# EAGLE design MaTouch Devkit_Stepper Driver V1.1 (EAGLE 6.1)
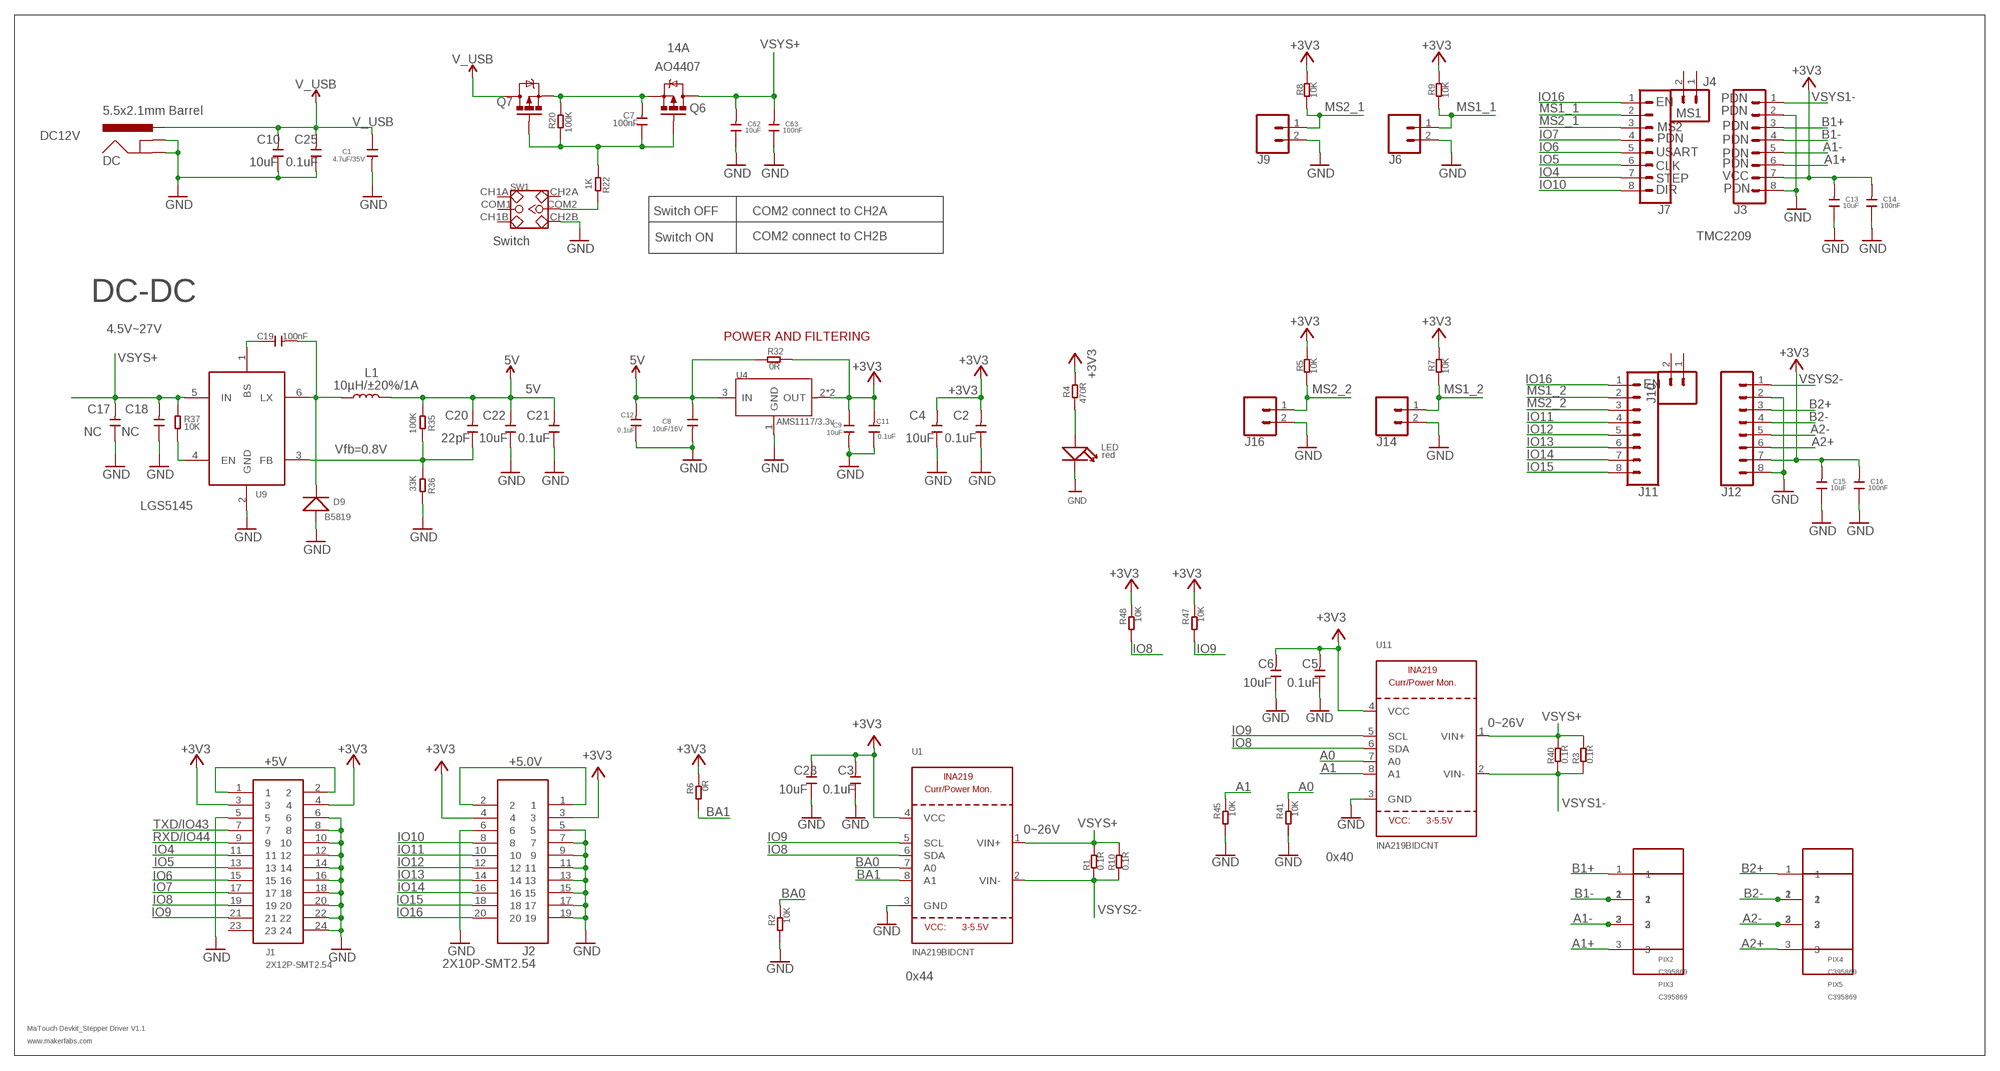
[diagram p0: schematic, sheet 1]

## Parts
C1  4.7uF/35V  C-0603  [0603]
C2  0.1uF  C-0603  [0603]
C3  0.1uF  C-0603  [0603]
C4  10uF  C-0603  [0603]
C5  0.1uF  C-0603  [0603]
C6  10uF  C-0603  [0603]
C7  100nF  C-0603  [0603]
C8  10uF/16V  C-0603  [0603]
C9  10uF  C-0603  [0603]
C10  10uF  C-0603  [0603]
C11  0.1uF  C-0603  [0603]
C12  0.1uF  C-0603  [0603]
C13  10uF  C-0603  [0603]
C14  100nF  C-0603  [0603]
C15  10uF  C-0603  [0603]
C16  100nF  C-0603  [0603]
C17  NC  C-0603  [0603]
C18  NC  C-0603  [0603]
C19  100nF  C-0603  [0603]
C20  22pF  C-0603  [0603]
C21  0.1uF  C-0603  [0603]
C22  10uF  C-0603  [0603]
C23  10uF  C-0603  [0603]
C25  0.1uF  C-0603  [0603]
C62  10uF  C-0603  [0603]
C63  100nF  C-0603  [0603]
D9  B5819  D'1206'  [SOD123]
DC  5.5x2.1mm Barrel  POWER_JACKSMD  [POWER_JACK_SMD]
J1  2X12P-SMT2.54  [2X12P-SMT2.54]
J2  2X10P-SMT2.54  [2X10P-SMT2.54]
J3  CONN_08"  [1X08]
J4  CONN_02LOCK  [1X02_LOCK]
J6  CONN_02LOCK  [1X02_LOCK]
J7  CONN_08"  [1X08]
J9  CONN_02LOCK  [1X02_LOCK]
J10  CONN_02LOCK  [1X02_LOCK]
J11  CONN_08"  [1X08]
J12  CONN_08"  [1X08]
J14  CONN_02LOCK  [1X02_LOCK]
J16  CONN_02LOCK  [1X02_LOCK]
L1  10µH/±20%/1A  INDUCTOR-SRN6045-33UH  [SRN6045]
LED  red  DISCRETE_LED0603  [DISCRETE_LED-0603]
PIX2  C395869  [PIN_3P]
PIX3  C395869  [PIN_3P]
PIX4  C395869  [PIN_3P]
PIX5  C395869  [PIN_3P]
Q6  MOSFET-PCHANNELFDS6675  [SO08]
Q7  MOSFET-PCHANNELFDS6675  [SO08]
R1  0.1R  DISCRETE_R-2512  [DISCRETE_R2512]
R2  10K  R-0603  [R0603]
R3  0.1R  DISCRETE_R-2512  [DISCRETE_R2512]
R4  470R  R-0603  [R0603]
R5  10K  R-0603  [R0603]
R6  0R  R-0603  [R0603]
R7  10K  R-0603  [R0603]
R8  10K  R-0603  [R0603]
R9  10K  R-0603  [R0603]
R10  0.1R  DISCRETE_R-2512  [DISCRETE_R2512]
R20  100K  R-0603  [R0603]
R22  1K  R-0603  [R0603]
R32  0R  R-0603  [R0603]
R35  100K  R-0603  [R0603]
R36  33K  R-0603  [R0603]
R37  10K  R-0603  [R0603]
R40  0.1R  DISCRETE_R-2512  [DISCRETE_R2512]
R41  10K  R-0603  [R0603]
R45  10K  R-0603  [R0603]
R47  10K  R-0603  [R0603]
R48  10K  R-0603  [R0603]
SW1  SWITCH-2CH-6P'90D'  [6P-2CH-2.54-9.0X3.6-90D]
U1  INA219BIDCNT  INA219  [SOT23-8]
U4  AMS1117/3.3v  LD1117'SOT89'  [SOT89]
U9  SY8201ABC  [SOT-23-6]
U11  INA219BIDCNT  INA219  [SOT23-8]

## Nets
5V: C8.1 C12.2 C20.2 C21.2 C22.2 L1.2 R32.1 R35.1 U4.3(IN)
+3V3: C2.2 C3.2 C4.2 C5.2 C6.2 C9.1 C11.2 C13.2 C14.2 C15.2 C16.2 C23.2 J1.3 J1.4 J2.3 J2.4 J3.7 J12.7 R4.2 R5.2 R6.2 R7.2 R8.2 R9.2 R32.2 R47.2 R48.2 U1.4(VCC) U4.2(OUT) U4.4(OUT) U11.4(VCC)
+5.0V: J2.1 J2.2
+5V: J1.1 J1.2
A0: R41.2 U11.7(A0)
A1: R45.2 U11.8(A1)
A1+: J3.6 PIX3.3
A1-: J3.5 PIX2.3 PIX3.2
A2+: J12.6 PIX5.3
A2-: J12.5 PIX4.3 PIX5.2
B1+: J3.3 PIX2.1
B1-: J3.4 PIX2.2 PIX3.1
B2+: J12.3 PIX4.1
B2-: J12.4 PIX4.2 PIX5.1
BA0: R2.2 U1.7(A0)
BA1: R6.1 U1.8(A1)
GND: C1.2 C2.1 C3.1 C4.1 C5.1 C6.1 C8.2 C9.2 C10.1 C11.1 C12.1 C13.1 C14.1 C15.1 C16.1 C17.1 C18.1 C21.1 C22.1 C23.1 C25.1 C62.1 C63.1 D9.+ DC.GND(GNDBREAK) DC.P$4(GND) J1.5 J1.6 J1.8 J1.10 J1.12 J1.14 J1.16 J1.18 J1.20 J1.22 J1.24 J2.5 J2.6 J2.7 J2.9 J2.11 J2.13 J2.15 J2.17 J2.19 J3.2 J3.8 J6.2 J9.2 J12.2 J12.8 J14.2 J16.2 LED.- R2.1 R36.2 R41.1 R45.1 SW1.CH2B U1.3(GND) U4.1(GND) U9.2(GND) U11.3(GND)
IO4: J1.11 J7.7
IO5: J1.13 J7.6
IO6: J1.15 J7.5
IO7: J1.17 J7.4
IO8: J1.19 R48.1 U1.6(SDA) U11.6(SDA)
IO9: J1.21 R47.1 U1.5(SCL) U11.5(SCL)
IO10: J2.8 J7.8
IO11: J2.10 J11.4
IO12: J2.12 J11.5
IO13: J2.14 J11.6
IO14: J2.16 J11.7
IO15: J2.18 J11.8
IO16: J2.20 J7.1 J11.1
MS1_1: J6.1 J7.2 R9.1
MS1_2: J11.2 J14.1 R7.1
MS2_1: J7.3 J9.1 R8.1
MS2_2: J11.3 J16.1 R5.1
N$2: LED.+ R4.1
N$9: C7.1 Q6.4(G) Q7.4(G) R20.2 R22.2
N$10: R22.1 SW1.COM2
N$41: C19.2 D9.- L1.1 U9.6(LX)
N$42: C19.1 U9.1(BS)
N$43: C20.1 R35.2 R36.1 U9.3(FB)
N$44: R37.2 U9.4(EN)
N$49: C7.2 Q6.1(S) Q6.2(S) Q6.3(S) Q7.1(S) Q7.2(S) Q7.3(S) R20.1
RXD/IO44: J1.9
TXD/IO43: J1.7
V_USB: C1.1 C10.2 C25.2 DC.VIN0(PWR) Q7.5(D) Q7.6(D) Q7.7(D) Q7.8(D)
VSYS1-: J3.1 R3.1 R40.1 U11.2(VIN-)
VSYS2-: J12.1 R1.1 R10.1 U1.2(VIN-)
VSYS+: C17.2 C18.2 C62.2 C63.2 Q6.5(D) Q6.6(D) Q6.7(D) Q6.8(D) R1.2 R3.2 R10.2 R37.1 R40.2 U1.1(VIN+) U9.5(IN) U11.1(VIN+)
Unconnected: J1.23 J4.1 J4.2 J10.1 J10.2 SW1.CH1A SW1.CH1B SW1.CH2A SW1.COM1

## Notes on the sheet
- 14A
- AO4407
- PDN
- EN
- MS1 | PDN
- MS2 | PDN
- DC12V | PDN
- PDN
- USART | PDN
- CLK | PDN
- STEP | VCC
- DIR | PDN
- Switch OFF | COM2 connect to CH2A
- Switch ON | COM2 connect to CH2B | TMC2209
- Switch
- DC-DC
- 4.5V~27V
- POWER AND FILTERING
- EN
- Vfb=0.8V
- LGS5145
- 0~26V
- 0~26V
- 0x40
- 0x44
- MaTouch Devkit_Stepper Driver V1.1
- www.makerfabs.com

## Library data of the parts
C1-C23 C25 C62 C63 = Discrete:C*: Ceramic Capacitors
D9 = Discrete:D*
DC = SparkFun-Connectors:POWER_JACK: Power Jack Connector This is the standard 5.5mm barrel jack for power. The PTH is the most common, proven, reliable, footprint. The Slot footprint only works if the mill layer is transmitted to the PCB fab house so be warned. Here are the connectors we sell at SparkFun: DC Barrel Power Jack/Connector <https://www.sparkfun.com/products/119> (PRT-00119) DC Barrel Power Jack/Connector (SMD) <https://www.sparkfun.com/products/12748> (PRT-12748) DC Barrel Jack Adapter - Breadboard Compatible <https://www.sparkfun.com/products/10811> (PRT-10811) It is used on this SparkFun product (and many, many others): SparkFun RedBoard - Programmed with Arduino <https://www.sparkfun.com/products/12757> (DEV-12757) Also, if you need a mating power supply or connector, please check these out: Wall Adapter Power Supply - 9VDC 650mA <https://www.sparkfun.com/products/298> (TOL-00298) DC Barrel Jack Adapter - Male <https://www.sparkfun.com/products/10287> (PRT-10287); PROD_ID: CONN-08106; SF_ID: PRT-12748
J1 = sale:2X12P-SMT2.54
J2 = sale:2X10P-SMT2.54
J3 J7 J11 J12 = SparkFun-Connectors:CONN_08: Multi connection point. Often used as Generic Header-pin footprint for 0.1 inch spaced/style header connections On any of the 0.1 inch spaced packages, you can populate with these: Break Away Headers - Straight <https://www.sparkfun.com/products/116> (PRT-00116) Break Away Male Headers - Right Angle <https://www.sparkfun.com/products/553> (PRT-00553) Female Headers <https://www.sparkfun.com/products/115> (PRT-00115) Break Away Headers - Machine Pin <https://www.sparkfun.com/products/117> (PRT-00117) Break Away Female Headers - Swiss Machine Pin <https://www.sparkfun.com/products/743> (PRT-00743) Arduino Stackable Header - 8 Pin <https://www.sparkfun.com/products/9279> (PRT-09279) For SCREWTERMINALS and SPRING TERMINALS visit here: Screw Terimnals on SparkFun.com <https://www.sparkfun.com/search/results?term=Screw+Terminals> (5mm/3.5mm/2.54mm spacing) This device is also useful as a general connection point to wire up your design to another part of your project. Our various solder wires solder well into these plated through hole pads. Hook-Up Wire - Assortment (Stranded, 22 AWG) <https://www.sparkfun.com/products/11375> (PRT-11375) Hook-Up Wire - Assortment (Solid Core, 22 AWG) <https://www.sparkfun.com/products/11367> (PRT-11367) View the entire wire category on our website here <https://www.sparkfun.com/categories/141> Special notes: Molex polarized connector foot print use with SKU : PRT-08231 with associated crimp pins and housings. 1MM SMD Version SKU: PRT-10208 NOTES ON THE VARIANTS LOCK and LOCK_LONGPADS... This footprint was designed to help hold the alignment of a through-hole component (i.e. 6-pin header) while soldering it into place. You may notice that each hole has been shifted either up or down by 0.005 of an inch from it's more standard position (which is a perfectly straight line). This slight alteration caused the pins (the squares in the middle) to touch the edges of the holes. Because they are alternating, it causes a "brace" to hold the component in place. 0.005 has proven to be the perfect amount of "off-center" position when using our standard breakaway headers. Although looks a little odd when you look at the bare footprint, once you have a header in there, the alteration is very hard to notice. Also,if you push a header all the way into place, it is covered up entirely on the bottom side.; PROD_ID: CONN-08438
J4 J6 J9 J10 J14 J16 = SparkFun-Connectors:CONN_02: Multi connection point. Often used as Generic Header-pin footprint for 0.1 inch spaced/style header connections On any of the 0.1 inch spaced packages, you can populate with these: Break Away Headers - Straight <https://www.sparkfun.com/products/116> (PRT-00116) Break Away Male Headers - Right Angle <https://www.sparkfun.com/products/553> (PRT-00553) Female Headers <https://www.sparkfun.com/products/115> (PRT-00115) Break Away Headers - Machine Pin <https://www.sparkfun.com/products/117> (PRT-00117) Break Away Female Headers - Swiss Machine Pin <https://www.sparkfun.com/products/743> (PRT-00743) For SCREWTERMINALS and SPRING TERMINALS visit here: Screw Terimnals on SparkFun.com <https://www.sparkfun.com/search/results?term=Screw+Terminals> (5mm/3.5mm/2.54mm spacing) This device is also useful as a general connection point to wire up your design to another part of your project. Our various solder wires solder well into these plated through hole pads. Hook-Up Wire - Assortment (Stranded, 22 AWG) <https://www.sparkfun.com/products/11375> (PRT-11375) Hook-Up Wire - Assortment (Solid Core, 22 AWG) <https://www.sparkfun.com/products/11367> (PRT-11367) View the entire wire category on our website here <https://www.sparkfun.com/categories/141> Special notes: Molex polarized connector foot print use with: PRT-08233 with associated crimp pins and housings. 2.54_SCREWTERM for use with PRT-10571. 3.5mm Screw Terminal footprints for PRT-08084 5mm Screw Terminal footprints for use with PRT-08432
L1 = SparkFun-Coils:INDUCTOR: Inductors Resist changes in electrical current. Basically a coil of wire. SparkFun Products: SparkFun Load Cell Amplifier - HX711 <https://www.sparkfun.com/products/13879> IOIO-OTG - V2.2 <https://www.sparkfun.com/products/13613>; PROD_ID: NDUC-11627; VALUE: 33µH/±20%/1.4A
LED = A9G:DISCRETE_LED*
PIX2-PIX5 = 1mytest:C395869
Q6 Q7 = User-Submitted:MOSFET-PCHANNEL: Generic PMOSFET IRLML2244 - TRANS-11153 (SOT-23 -20V -4.3A) (1.Gate 2.Source 3.Drain) FQP27P06 - COM-10349 <http://www.sparkfun.com/products/10349> (TO-220 -60V -27A) (1.Gate 2.Source 3.Drain)
R1 R3 R10 R40 = A9G:DISCRETE_R*
R2 R4-R9 R20 R22 R32 R35-R37 R41 R45 R47 R48 = Discrete:R*
SW1 = Discrete:SWITCH-2CH-6P
U1 U11 = microbuilder:INA219: INA219 - I2C Current/Power Monitor Voltage Range: 0-26V Accuracy: 0.5% Temperature: -40°C - 125°C
U4 = IC:LD1117: Low Drop Fixed And Adjustable Positive Voltage Regulators http://www.datasheetcatalog.org/datasheet/SGSThomsonMicroelectronics/mXuqtqv.pdf
U9 = self:SY8201ABC

## Net classes
0 default: width 0.203 mm, drill 0.305 mm, clearance 0.152 mm

## Board
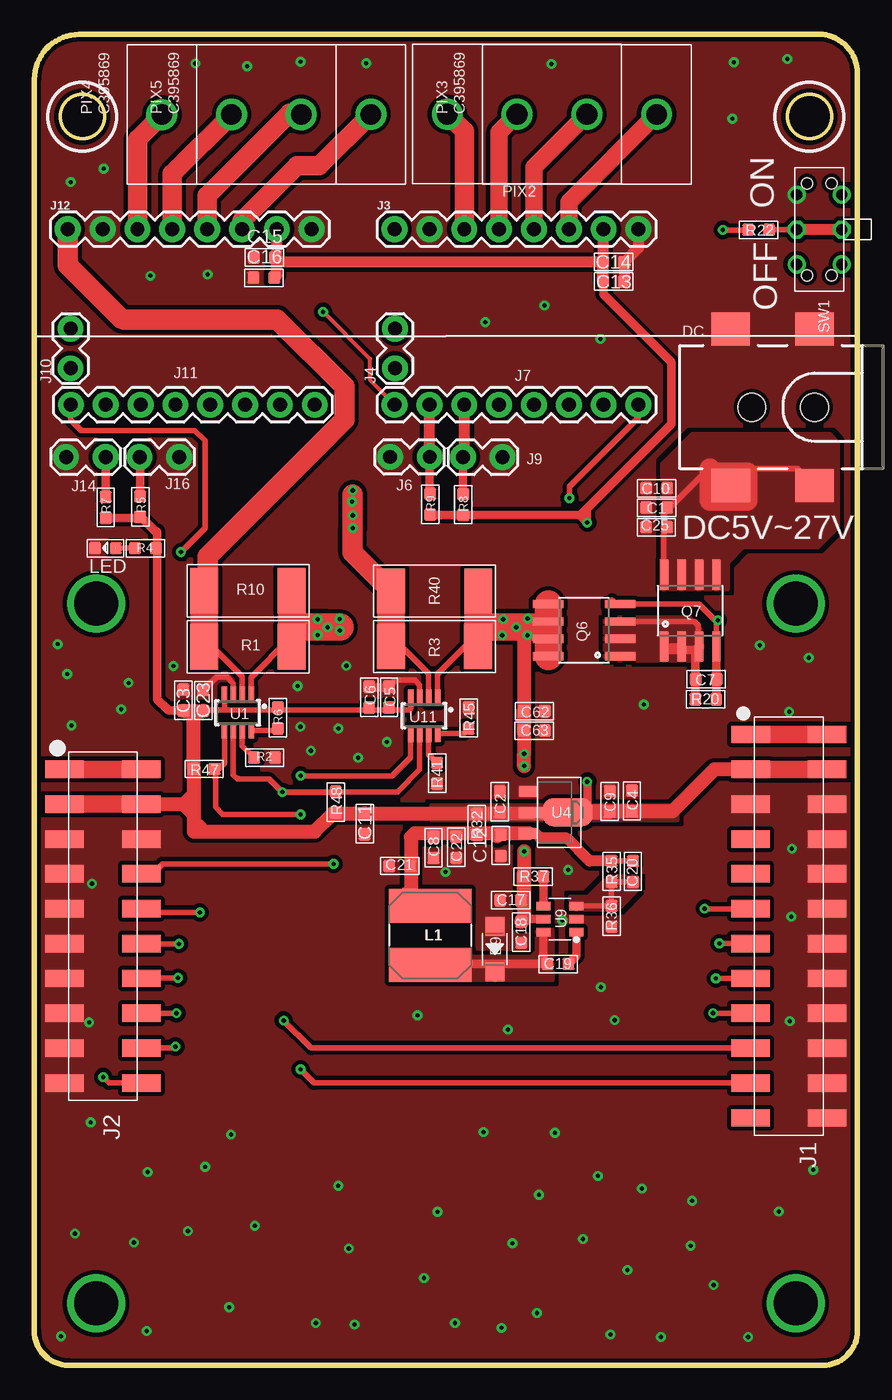
[diagram p1: board, top side]
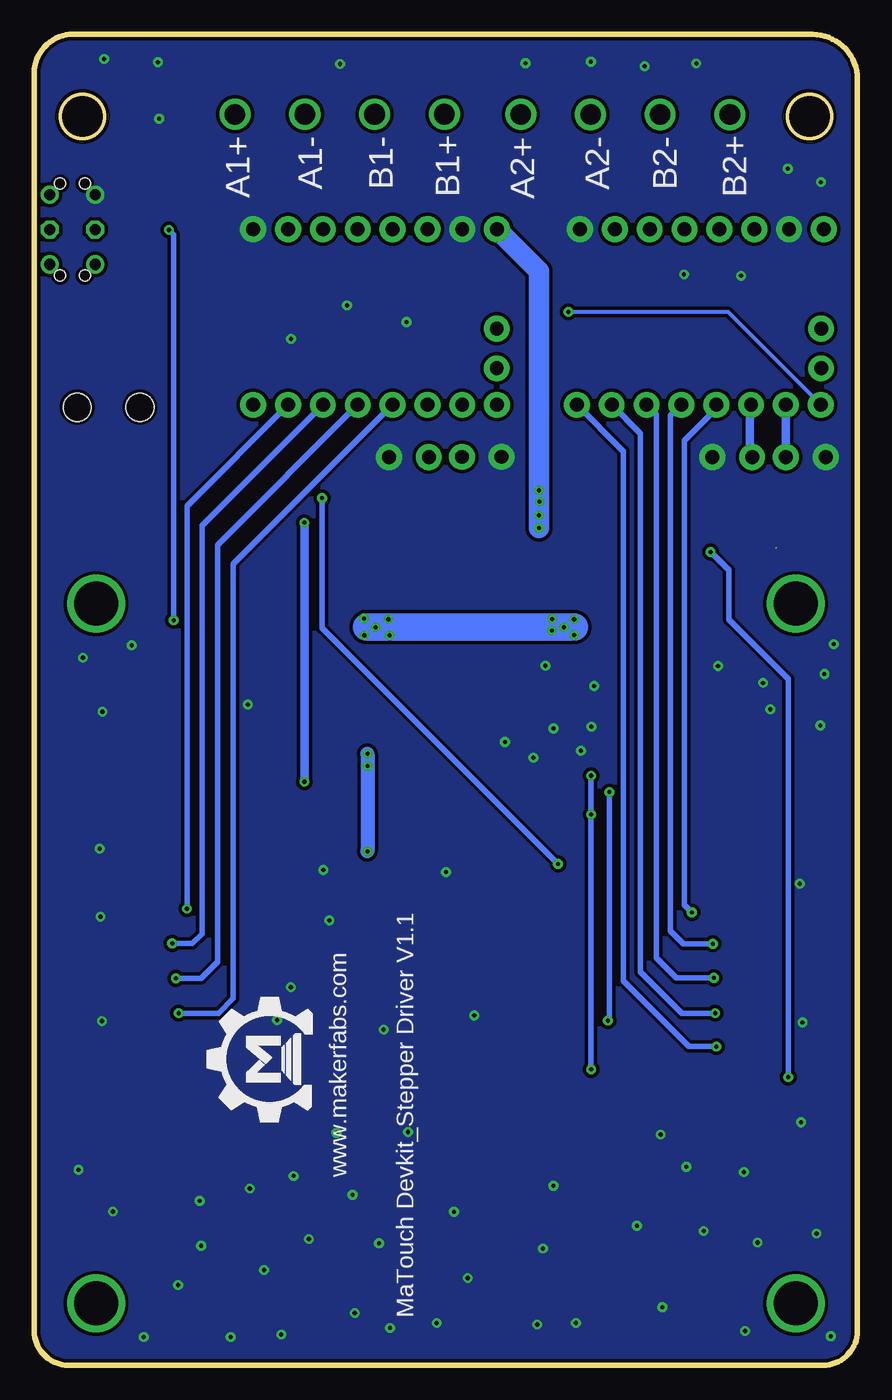
[diagram p2: board, bottom side, seen from below]

Size 60 x 97 mm. Coordinates in mm from the lower left corner, seen from the top.
Outline: 2.5,0 57.5,0 arc90 60,2.5 60,94.16 arc90 57.16,97 3.27,97 arc90 0,93.73 0,2.5 arc90 2.5,0
Outline: circle at 3.5,91 radius 1.6
Outline: circle at 56.5,91 radius 1.6
Copper layers (1*16): Top 0.035mm / dielectric 1.5mm / Bottom 0.035mm
Design rules: minimum track width 10mil, minimum drill 10mil, track to track 8mil, track to pad 8mil, pad to pad 8mil, via to via 8mil, smd to smd 0mil, copper to edge 10mil, drill to drill 8mil, minimum pad ring 10mil, minimum via ring 8mil, stop-mask expansion 4mil, vias tented up to drill 30mil, thermal gap 0mil
tRestrict: area 25.9,30.4 to 31.9,32.2

### Footprints (pad centres in the part's own frame; a part is rotated, then mirrored left to right if it is on the bottom)
0603 = smd 0.889 x 0.889: 1 -0.762,0; 2 0.762,0
SOD123 = smd 1.397 x 1.397: + -1.651,0; - 1.651,0
POWER_JACK_SMD = smd 2.8 x 2.4: GND 0,-5.7; P$4 6.1,-5.7; VIN0 0,5.7; VIN1 6.1,5.7 | hole 2.032: 0,0; 4.572,0
2X12P-SMT2.54 = smd 1.27 x 2.8: 1 -13.97,-2.8; 2 -13.97,2.8; 3 -11.43,-2.8; 4 -11.43,2.8; 5 -8.89,-2.8; 6 -8.89,2.8; 7 -6.35,-2.8; 8 -6.35,2.8; 9 -3.81,-2.8; 10 -3.81,2.8; 11 -1.27,-2.8; 12 -1.27,2.8; 13 1.27,-2.8; 14 1.27,2.8; 15 3.81,-2.8; 16 3.81,2.8; 17 6.35,-2.8; 18 6.35,2.8; 19 8.89,-2.8; 20 8.89,2.8; 21 11.43,-2.8; 22 11.43,2.8; 23 13.97,-2.8; 24 13.97,2.8
2X10P-SMT2.54 = smd 1.27 x 2.8: 1 -11.43,-2.8; 2 -11.43,2.8; 3 -8.89,-2.8; 4 -8.89,2.8; 5 -6.35,-2.8; 6 -6.35,2.8; 7 -3.81,-2.8; 8 -3.81,2.8; 9 -1.27,-2.8; 10 -1.27,2.8; 11 1.27,-2.8; 12 1.27,2.8; 13 3.81,-2.8; 14 3.81,2.8; 15 6.35,-2.8; 16 6.35,2.8; 17 8.89,-2.8; 18 8.89,2.8; 19 11.43,-2.8; 20 11.43,2.8
1X08 = drill 1.016 pad 1.88: 1 0,0; 2 2.54,0; 3 5.08,0; 4 7.62,0; 5 10.16,0; 6 12.7,0; 7 15.24,0; 8 17.78,0
1X02_LOCK = drill 1.016 pad 1.88: 1 -0.178,0; 2 2.718,0
SRN6045 = smd 2.5 x 6: 1 -2.175,0; 2 2.125,0
DISCRETE_LED-0603 = smd 0.889 x 0.889: + -0.762,0; - 0.762,0
PIN_3P = drill 1.5: 1 0,10.16; 2 0,5.08; 3 0,0
SO08 = smd 0.61 x 2.21: 1 -1.905,-2.616; 2 -0.635,-2.616; 3 0.635,-2.616; 4 1.905,-2.616; 5 1.905,2.616; 6 0.635,2.616; 7 -0.635,2.616; 8 -1.905,2.616
DISCRETE_R2512 = smd 2.032 x 3.302: 1 -3.175,0; 2 3.175,0
R0603 = smd 0.889 x 0.889: 1 -0.762,0; 2 0.762,0
6P-2CH-2.54-9.0X3.6-90D = drill 0.813 pad 1.27: CH1A -2.54,-1.65; CH1B 2.54,-1.65; CH2A -2.54,1.65; CH2B 2.54,1.65 | drill 0.813 pad 1.27 octagon: COM1 0,-1.65; COM2 0,1.65 | hole 0.813: -3.35,0.9; -3.35,-0.9; 3.35,0.9; 3.35,-0.9
SOT23-8 = smd 0.4 x 1.2: 1 -0.975,-1.3; 2 -0.325,-1.3; 3 0.325,-1.3; 4 0.975,-1.3; 5 0.975,1.3; 6 0.325,1.3; 7 -0.325,1.3; 8 -0.975,1.3
SOT89 = smd 0.8 x 1.4: 1 -1.524,-1.905; 3 1.524,-1.905 | smd 0.8 x 1.9: 2 0,-1.651 | smd 2.032 x 3.65: 4 0,0.94
SOT-23-6 = smd 1 x 0.6: 1 -1.2,0.95; 2 -1.2,0; 3 -1.2,-0.95; 4 1.2,-0.95; 5 1.2,0; 6 1.2,0.95

### Placement (x,y rotation side)
C1  45.36,62.5 180 top
C2  33.94,41.07 270 top
C3  10.87,48.47 270 top
C4  43.56,41.12 270 top
C5  25.86,48.69 270 top
C6  24.41,48.68 270 top
C7  48.97,50 180 top
C8  29.1,37.73 270 top
C9  41.95,41.08 90 top
C10  45.36,63.92 0 top
C11  24.08,39.46 90 top
C12  34.01,37.88 90 top
C13  42.24,78.98 180 top
C14  42.24,80.4 180 top
C15  16.76,80.73 0 top
C16  16.74,79.26 0 top
C17  34.72,33.9 0 top
C18  35.51,31.55 90 top
C19  38.18,29.24 180 top
C20  43.64,35.98 90 top
C21  26.63,36.39 0 top
C22  30.76,37.74 90 top
C23  12.32,48.45 270 top
C25  45.35,61.08 0 top
C62  36.46,47.67 180 top
C63  36.44,46.25 180 top
D9  33.58,30.32 270 top
DC  56.87,69.82 180 top
J1  55,32 270 top
J2  5,32 270 top
J3  26.26,82.8 0 top
J4  26.29,72.83 90 top
J6  28.65,66.2 180 top
J7  26.26,70 0 top
J9  31.42,66.18 0 top
J10  2.64,72.83 90 top
J11  2.67,70 0 top
J12  2.44,82.8 0 top
J14  5.03,66.18 180 top
J16  7.85,66.18 0 top
L1  28.86,31.35 90 top
LED  5.18,59.55 180 top
PIX2  40.26,91.18 90 top
PIX3  45.36,91.17 90 top
PIX4  19.46,91.15 90 top
PIX5  24.54,91.17 90 top
Q6  40.08,53.57 90 top
Q7  47.82,55 0 top
R1  15.57,52.36 0 top
R2  16.79,44.28 180 top
R3  29.17,52.38 0 top
R4  8.1,59.55 0 top
R5  7.72,62.57 270 top
R6  17.75,47.18 90 top
R7  5.21,62.52 270 top
R8  31.27,62.72 270 top
R9  28.85,62.75 270 top
R10  15.57,56.45 0 top
R20  48.95,48.54 0 top
R22  52.81,82.75 180 top
R32  32.27,39.41 90 top
R35  42.08,35.98 270 top
R36  42.08,32.71 270 top
R37  36.36,35.61 0 top
R40  29.18,56.42 0 top
R41  29.36,43.14 90 top
R45  31.66,47.17 270 top
R47  12.38,43.45 180 top
R48  21.97,41.03 270 top
SW1  57.22,82.77 90 top
U1  14.83,47.56 180 top
U4  37.95,40.29 270 top
U9  38.32,32.51 180 top
U11  28.42,47.33 180 top
U$2  [MAKERFABS_0.3]  39.79,18.18 90 bottom

### Tracks (layer width: path | path; a pad name or v marks a point on that pad's centre or on a via)
5V
  Top 0.254: 27.09,36.39 C21.2 27.09,34.54 27.61,34.02 | 27.7,33.93 28.14,33.49 28.84,33.49 L1.2 | 27.46,38.49 C8.1 30.74,38.49 C22.2
  Top 0.406: C20.2 R35.1 | U4.3 36.24,38.57 | C22.2 32.13,38.5 R32.1 32.26,38.64
  Top 0.813: R35.1 40.48,36.74 38.81,38.42 36.88,38.42 36.55,38.75 36.06,38.75 U4.3 | 27.38,34.53 27.18,34.33 27.18,34.38 27.08,34.48 27.15,34.48 27.61,34.02 | C12.2 34.09,38.65 34.11,38.62 34.11,38.66 34.21,38.77
  Top 1.016: U4.3 34.21,38.77 33.68,38.77 | 33.68,38.77 27.73,38.77 27.46,38.49 27.46,34.17 27.61,34.02 27.7,33.93 | 33.76,38.54 33.68,38.62 33.68,38.77
+3V3  (via drill 0.3)
  Top 0.254: 27.46,48.58 U11.4
  Top 0.406: 43.58,40.34 C4.2 41.99,40.36 C9.1 | U4.4 U4.2 33.95,40.29 C2.2 32.4,40.3 R32.2 32.03,40.4 | 13.15,39.08 13.34,38.89 | C23.2 12.32,47.74 13.89,47.74 | 13.89,47.74 17.8,47.74 | 17.8,47.74 24.46,47.74 | 24.46,47.74 25.98,47.74 | 25.98,47.74 27.2,47.74 arc90 27.46,47.99 27.46,48.58 | R6.2 17.75,47.79 arc90 17.8,47.74 | C6.2 24.41,47.79 arc90 24.46,47.74 | C5.2 25.86,47.86 arc90 25.98,47.74 | U1.4 13.86,47.77 arc90 13.89,47.74 | 11.56,47.22 11.62,47.28 | R48.2 21.97,40.22 | 11.48,41.84 10.49,40.85 | 10.49,40.85 11.58,39.76 11.58,39.97 11.66,40.04 12.52,39.18 | 10.49,40.85 11.33,40.85 11.35,40.88 11.35,40.89 11.36,40.89 | R4.2 8.97,59.55 8.97,59.5
  Top 0.61: 8.97,60.77 8.97,59.73 | 8.97,59.73 8.97,59.5 8.97,48.52 9.78,47.71 C3.2 | R7.2 7.75,61.76 | 7.75,61.76 7.85,61.76 7.87,61.73 8.97,60.64 8.97,59.73 | R5.2 7.75,61.78 7.75,61.76 | R9.2 28.88,61.96 R8.2 39.8,61.96 | C14.2 41.45,80.38 41.45,80.17 41.48,80.15 41.48,78.07 46.43,73.11 46.43,68.59 40.28,62.44 | 39.8,61.96 39.8,61.91 v40.31,61.4 | v40.31,42.53 40.31,40.32 40.26,40.27 40.39,40.27 40.49,40.37 | 39.8,61.96 40.28,62.44 | 40.28,61.4 40.28,62.44
  Top 0.813: 41.48,82.48 C14.2 C13.2 41.43,79.03 41.43,80.38 41.4,80.4 17.7,80.4 17.68,80.38 | 41.48,82.48 41.48,82.84 41.53,82.89 | J3.7 41.5,82.51 41.48,82.48 | J12.7 17.68,80.58 | C16.2 17.68,79.44 17.68,80.38 | 17.68,80.38 17.68,80.58 | 17.68,80.58 C15.2
  Top 1.016: 39.4,40.29 U4.4 arc-90 38.82,40.22 C11.2 21.97,40.22 21.77,40.22 20.44,38.89 13.34,38.89 11.62,38.89 11.62,40.63 | 39.4,40.29 41.92,40.29 C9.1 | C3.2 10.9,47.69 11.62,47.69 | 11.62,47.69 C23.2 | 11.62,47.69 11.62,47.28 R47.2 11.62,40.63 | J1.3 49.59,43.43 46.53,40.37 40.49,40.37 39.48,40.37 39.4,40.29 | J2.4 11.36,40.89 11.62,40.63
  Top 1.27: J1.3 J1.4 | J2.3 J2.4
  Bottom 0.61: v40.31,61.4 v40.31,42.53
  pour Top: 28.93,39.69 46.91,39.69 46.91,40.83 28.93,40.83
+5.0V
  Top 1.27: J2.2 J2.1
+5V
  Top 1.27: J1.2 J1.1
A0
  Top 0.406: U11.7 28.75,44.52 R41.2
A1
  Top 0.254: 31.67,46.37 31.67,46.39 31.67,46.4 R45.2
  Top 0.406: U11.8 31.34,46.03 31.67,46.37
A1+
  Top 1.27: J3.6 38.96,84.77 PIX3.3
A1-
  Top 1.27: J3.5 36.42,87.31 PIX3.2 PIX2.3
A2+
  Top 1.422: J12.6 15.14,83.4 19.15,87.41 20.78,87.41 PIX5.3
A2-
  Top 0.61: PIX4.3 PIX5.2
  Top 1.422: J12.5 12.6,85.25 18.59,91.25 19.38,91.25 PIX5.2
B1+
  Top 1.422: J3.3 31.34,89.94 PIX2.1
B1-
  Top 0.254: PIX3.1 PIX2.2
  Top 0.61: 35.23,91.22 PIX2.2 PIX3.1 PIX2.2
  Top 1.27: J3.4 33.88,89.88 PIX2.2 35.23,91.22
B2+
  Top 0.61: PIX4.1 9.32,91.15
  Top 1.422: J12.3 7.52,89.34 9.32,91.15
B2-
  Top 1.422: J12.4 10.06,86.83 PIX4.2 PIX5.1
BA0
  Top 0.254: U1.7
  Top 0.406: R2.2 15.16,45.15 U1.7
BA1
  Top 0.406: R6.1 17.6,46.26 U1.8
GND  (via drill 0.3)
  Top 0.406: U1.3 14.51,49.69 14.05,50.15 13.28,50.15 12.34,49.21 C23.1 | U11.3 28.09,49.57 27.74,49.92 26.54,49.92 26.26,49.92 26.26,49.85 C5.1
  Top 0.61: C5.1 25.93,49.45 25.93,49.39 24.41,49.39 C6.1
  Top 0.813: J3.8 44.04,81.44 C14.1 C13.1
  other vias: 32.87,76.02 4.2,35.1 8.19,2.49 7.27,8.94 3.99,24.99 2.97,9.6 16.08,10.16 4.11,17.7 12.46,14.45 1.94,2.1 22.15,13.08 14.21,4.22 36.64,3.81 30.67,3.07 45.68,2.06 42,2.23 28.41,6.35 56.78,14.25 43.24,6.93 49.52,5.84 52.03,2.06 37.2,77.24 22.92,8.51 36.79,12.42 8.27,14.07 8.47,79.4 12.64,79.5 55.03,47.62 55.18,32.69 55.23,37.64 55.07,25.08 34.53,24.46 39.99,9.19 34.86,8.89 47.84,8.71 54.27,11.2 32.75,16.99 37.96,16.94 42.3,25.14 27.93,25.5 38.93,36.09 29.98,35.94 6.34,47.8 10.15,50.95 1.71,52.55 6.87,49.73 2.4,50.37 5.07,87.2 15.51,94.66 2.65,86.23 24.19,94.89 37.71,94.84 11.75,94.87 19.42,94.99 54.9,95.2 50.89,90.85 50.99,94.97 44.44,48.16 52.9,52.48 56.45,51.56 14.34,16.81 44.28,12.88 38.49,32.41 29.4,11.17 2.7,46.63 23.34,2.97 20.52,3.07 11.2,9.78 47.95,11.99 41.27,74.8 34.06,2.72 41.3,27.56 41.1,13.79 19.19,49.5 22.75,50.98 20.15,44.78 25.69,45.41 22.16,46.4 19.39,46.53 23.61,44.27
  pour Bottom (isolate 0.254, rank 4): -1.2,-15.8 -1.2,108 80,108 80,-15.8
  pour Top (isolate 0.305, rank 4, no thermals): -0.6,-15.8 -0.6,110 80,110 80,-15.8
IO4  (via drill 0.3)
  Top 0.406: v48.87,33.28 v48.88,33.27 J1.11
  Bottom 0.406: J7.7 48.87,62.63 v48.87,33.28
IO5  (via drill 0.3)
  Top 0.406: v49.95,30.74 v49.96,30.73 J1.13
  Bottom 0.406: J7.6 47.78,61.19 47.78,31.45 48.48,30.74 v49.96,30.74 v49.95,30.74 v49.94,30.74
IO6  (via drill 0.3)
  Top 0.406: v49.68,28.2 49.69,28.19 J1.15
  Bottom 0.406: J7.5 46.63,59.79 46.63,29.39 47.83,28.2 v49.68,28.2
IO7  (via drill 0.3)
  Top 0.406: v49.48,25.66 v49.49,25.65 J1.17
  Bottom 0.406: J7.4 45.49,58.39 45.49,26.73 46.56,25.66 v49.48,25.66
IO8  (via drill 0.3)
  Top 0.406: U11.6 28.1,43.42 26.47,41.79 R48.1 | 21.79,41.79 18.01,41.79 18.01,41.77 18.03,41.77 | v18.09,41.77 18.06,41.77 | U1.6 14.51,43.03 14.83,42.71 14.94,42.71 | 14.94,42.71 14.96,42.71 | 18.06,41.77 17.12,42.71 14.96,42.71 | 18.06,41.77 18.03,41.77 | 18.03,41.77 18.03,41.74 | 14.94,42.73 14.96,42.71 | R48.1 21.92,41.79 21.89,41.77 21.87,41.77 21.84,41.74 21.89,41.74 21.92,41.77 21.84,41.77 | 21.84,41.77 21.82,41.77 21.79,41.79 | R48.1 21.79,41.79 | 21.84,41.79 21.82,41.79 21.77,41.74 | 21.77,41.74 21.82,41.74 21.84,41.77 | 21.77,41.74 18.09,41.74 18.06,41.77 | 14.94,42.71 14.94,42.73 | 14.91,42.76 14.94,42.73 | J1.19 20.18,23.11 18.19,25.11 v18.19,25.12
  Bottom 0.406: v18.19,25.12 18.09,25.12 v18.09,41.77
IO9  (via drill 0.3)
  Top 0.406: U1.5 13.86,43.89 13.46,43.5 13.16,43.5 13.14,43.48 R47.1 13.15,43.21 13.34,43.4 13.21,43.52 13.21,40.68 13.74,40.14 v19.41,40.14 | v19.41,42.96 26.09,42.96 27.43,44.31 27.43,46.02 U11.5 | J1.21 20.39,20.57 v19.41,21.55
  Bottom 0.406: v19.41,21.55 19.41,40.07 v19.41,40.14 v19.41,42.96
IO10  (via drill 0.3)
  Top 0.406: J7.8 44.04,69.05 39.01,64.02 v39.01,63.2 | v21.82,36.54 13.31,36.54 9.35,36.54 8.74,35.93 8.64,35.83 8.15,35.83 8.14,35.81 J2.8
  Bottom 0.406: v39.01,63.2 39.01,53.73 v21.82,36.54
IO11  (via drill 0.3)
  Top 0.406: v12.06,33 8.07,33 J2.10
  Bottom 0.406: J11.4 10.29,69.71 12.6,67.4 12.6,34 12.6,33.53 v12.06,33
IO12  (via drill 0.3)
  Top 0.406: v10.54,30.71 8.08,30.71 8.08,30.72 J2.12
  Bottom 0.406: J11.5 13.61,69.21 13.61,31.65 12.68,30.71 v10.54,30.71
IO13  (via drill 0.3)
  Top 0.406: v10.46,28.23 7.84,28.23 arc90 J2.14
  Bottom 0.406: J11.6 14.66,69.29 14.66,29.7 13.19,28.23 v10.46,28.23 v10.46,28.22
IO14  (via drill 0.3)
  Top 0.406: v10.36,25.66 v10.35,25.65 J2.16
  Bottom 0.406: J11.7 15.8,67.89 15.8,28.66 12.8,25.66 v10.36,25.66
IO15  (via drill 0.3)
  Top 0.406: v10.29,23.22 10.18,23.11 J2.18
  Bottom 0.406: J11.8 17.08,66.64 17.07,66.64 17.07,28.02 12.27,23.22 v10.29,23.22
IO16  (via drill 0.3)
  Top 0.305: J7.1 24.49,71.78 24.49,73.34 v21.06,76.77
  Top 0.406: v10.69,59.27 12.45,61.02 12.45,67.37 11.68,68.13 3.4,68.13 2.67,68.87 J11.1 | J2.20 5.45,20.57 v5.03,20.99 v5.03,21
  Bottom 0.305: v21.06,76.77 9.44,76.77 J11.1
  Bottom 0.406: v5.03,21 5.03,50 9.37,54.34 9.37,57.95 v10.69,59.27
MS1_1
  Top 0.254: 28.8,63.46 R9.1
  Top 0.61: 28.8,70.01 J7.2 | 28.83,63.44 28.8,63.46 28.8,66.33
  Top 0.813: 28.83,66.31 J6.1 28.8,66.23 28.8,66.33 J7.2
MS1_2
  Top 0.61: R7.1 J14.1 | J14.1 5.21,66.38 J14.1
  Bottom 0.254: 5.21,69.96 5.21,69.99 J11.2
  Bottom 0.61: J14.1 5.21,69.96 5.23,69.99
  Bottom 0.813: 5.21,70.01 J11.2
MS2_1
  Top 0.61: R8.1 31.24,63.51 31.24,66.2 31.27,66.2
  Top 0.813: J9.1 31.27,66.2 31.34,66.28 J7.3
MS2_2
  Top 0.61: R5.1 7.72,66.13 J16.1
  Bottom 0.61: 7.85,69.9 7.85,66.36 J16.1
  Bottom 0.813: J11.3 7.85,69.9
N$1  (via drill 3.2)
  other vias: 4.5,4.5
N$2  (1 unrouted)
  Top 0.406: R4.1 5.89,59.55 5.89,59.62 6.04,59.62 6.04,59.52
N$6  (via drill 3.2)
  other vias: 55.5,4.5
N$7  (via drill 3.2)
  other vias: 55.5,55.5
N$8  (via drill 3.2)
  other vias: 4.5,55.5
N$9  (via drill 0.3)
  Top 0.406: Q7.4 49.72,54.2 | 49.72,54.2 48.45,55.47 Q6.4 42.61,55.56 42.32,55.56 42.11,55.76 | 49.72,54.2 49.73,54.19 v49.84,54.29 | v50.19,82.74 52.03,82.74 R22.2
  Top 0.61: R20.2 49.71,49.85 | 49.71,49.85 49.71,52.38 Q7.4 | C7.1 49.73,49.87 49.71,49.85
  Bottom 0.406: v49.84,54.29 49.84,82.38 v50.19,82.74
N$10
  Top 0.406: R22.1 53.58,82.77 SW1.COM2
  Top 0.813: 58.85,82.77 55.63,82.77 55.6,82.74 SW1.COM2
N$41
  Top 0.61: 33.53,29.24 C19.2 37.12,29.54 U9.6 | 33.53,29.24 28.93,29.24 L1.1 | D9.- 33.58,29.2 33.53,29.24
  pour Top: 25.98,28.05 37.8,28.05 37.8,31.76 36.6,31.76 36.6,30.19 36.22,29.81 25.98,29.81
N$42
  Top 0.61: C19.1 39.52,29.83 U9.1
N$43
  Top 0.406: U9.3 42.06,33.46 R36.1 R35.2 C20.1
  pour Top: 39.04,33.18 42.57,33.18 44.12,34.73 44.12,35.67 41.86,35.67 40.36,34.17 39.04,34.17
N$44
  Top 0.61: U9.4 37.12,35.46 R37.2
N$49
  Top 0.406: Q6.3 48.12,54.2 48.41,53.91 48.41,52.42 | 48.41,52.42 Q7.3 | 48.41,52.42 48.41,52.39 48.46,52.33
  Top 0.61: 48.19,52.12 R20.1 48.19,49.98 C7.2 | 48.19,52.12 Q7.3 | 48.19,52.12 46.18,52.12 | 46.18,52.12 Q7.1 | 46.18,52.12 46.18,52.18 46.3,52.31 47.11,52.31 Q7.2
  pour Top: 41.58,54.52 47.75,54.52 48.72,53.55 48.72,51.32 41.66,51.32 41.58,51.4
V_USB
  Top 0.406: Q7.8 45.91,62.08 49.17,65.34 49.25,65.34 55.65,65.34 DC.VIN0 56.94,64.12 56.95,64.12
  Top 1.5: 49.25,65.34 49.25,63.03 51.97,63.03 51.97,65.06 49.94,65.06
  pour Top: 50.55,56.53 45.8,56.53 45.8,65.72 47.96,67.88 57.99,67.88 58.57,67.3 58.57,61.05 57.1,59.57 51.66,59.57 50.55,58.46
VSYS1-  (via drill 0.3)
  Top 0.406: U11.2 28.75,50.41 26.57,52.59 26.2,52.59 | 26.2,52.59 R3.1 | 26.2,52.59 26.2,52.71 26.24,52.74 | v23.16,62.95 23.16,63.72 v23.22,63.77
  Top 1.5: R40.1 23.22,59.22 23.22,61.05 | 23.22,63.46 23.22,61.05 | 23.22,61.05 v23.22,61.02
  Top 2: R40.1 26.01,52.38 R3.1
  Bottom 1.5: v23.22,61.94 23.22,62.24 | 23.22,62.24 v23.22,63.77 | v23.22,63.77 23.22,79.75 J3.1 | v23.22,63.77 23.22,62.24 | 23.22,62.24 v23.22,61.02
VSYS2-
  Top 0.305: 6.35,76.26 6.4,76.21 6.71,76.21
  Top 0.406: U1.2 15.16,50.18 13.01,52.33 12.42,52.33 R1.1
  Top 1.5: 6.35,76.26 2.44,80.17 J12.1 | 12.62,56.58 12.62,58.94 22.61,68.92 22.61,71.31 17.7,76.21 6.71,76.21 6.55,76.21 | 12.62,56.58 12.62,55.94 | R10.1 12.52,56.58 12.62,56.58
  Top 2: R1.1 R10.1
VSYS+  (via drill 0.3)
  Top 0.406: U1.1 15.81,50.14 18.62,52.94 18.82,52.94 | 18.82,52.94 18.85,52.97 | R1.2 18.75,52.87 18.82,52.94 | U11.1 29.4,50.39 31.57,52.56 32.16,52.56 R3.2 32.34,52.5 32.36,52.51 | 22.28,53.76 22.25,53.76 v22.25,54.39 20.65,54.39 v20.65,54.37 | v20.65,53.22 20.62,53.22 20.62,53.78
  Top 0.61: C18.2 35.51,32.83 | 35.51,32.83 35.51,33.87 C17.2 35.48,35.39 R37.1 | U9.5 35.82,32.51 35.51,32.83
  Top 0.813: 35.74,45.5 35.71,45.53 | C63.2 35.7,46.25 35.71,46.27
  Top 1.016: v35.13,53.78 35.71,53.78 35.71,46.27 35.71,45.53 v35.71,44.56 v35.71,43.67 35.71,43.65 | v35.71,37.45 35.71,32.52 35.59,32.4 35.59,32.39 C18.2 | C63.2 35.68,47.66 C62.2
  Top 1.676: 22.28,53.78 22.28,53.76
  Top 2: R40.2 32.36,53.86 | 32.36,53.86 32.36,52.38 R3.2 | R10.2 18.75,53.78 | 18.75,53.78 R1.2 | 37.46,53.78 Q6.7 Q6.8 | 37.46,53.78 Q6.6 | Q6.5 Q6.6 | 37.46,53.78 37.41,53.78 | 37.41,53.78 v35.13,53.78 32.44,53.78 32.36,53.86 | 18.75,53.78 20.62,53.78 v21.39,53.78 22.28,53.78 | Q6.6 37.46,53.98 37.39,53.91 37.39,53.81 37.41,53.78
  Bottom 0.61: v22.28,53.56 21.89,53.56 21.89,53.78 | v35.13,53.78 34.19,53.78 v34.19,54.37 | v35.97,54.42 35.64,54.42 35.64,53.78 | v35.94,53.2 35.94,53.78 34.14,53.78 | 34.11,53.78 v34.11,53.2
  Bottom 1.016: v35.71,44.56 v35.71,37.45
  Bottom 1.676: 20.62,53.78 20.62,53.83
  Bottom 2: 20.62,53.78 v21.39,53.78 21.89,53.78 34.11,53.78 34.14,53.78 v35.13,53.78 35.64,53.78 35.76,53.78

### Text on the board
tPlace: ON | OFF | DC5V~27V
bPlace: B2+ | B2- | A2- | A2+ | B1+ | B1- | A1- | A1+ | www.makerfabs.com | MaTouch Devkit_Stepper Driver V1.1